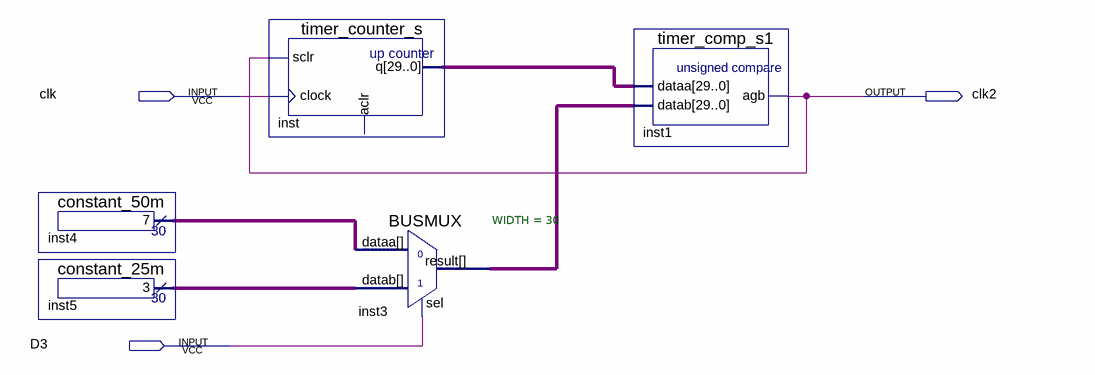
[diagram p0: schematic sheet]
// Quartus schematic devider_pres.bdf as structural Verilog: 5 symbols, 3 pins
module devider_pres (
  input  clk,
  input  D3,
  output clk2
);

  wire [29:0] inst3_result, inst4_result, inst5_result, inst_q;

  constant_50m inst4 (.result(inst4_result));
  constant_25m inst5 (.result(inst5_result));
  timer_counter_s inst (.sclr(clk2), .clock(clk), .q(inst_q));  // open: aclr
  BUSMUX #(.WIDTH(30)) inst3 (.datab(inst5_result), .sel(D3), .dataa(inst4_result), .result(inst3_result));
  timer_comp_s1 inst1 (.dataa(inst_q), .datab(inst3_result), .agb(clk2));
endmodule
